# Altium project CAN_BUS.PrjPcb
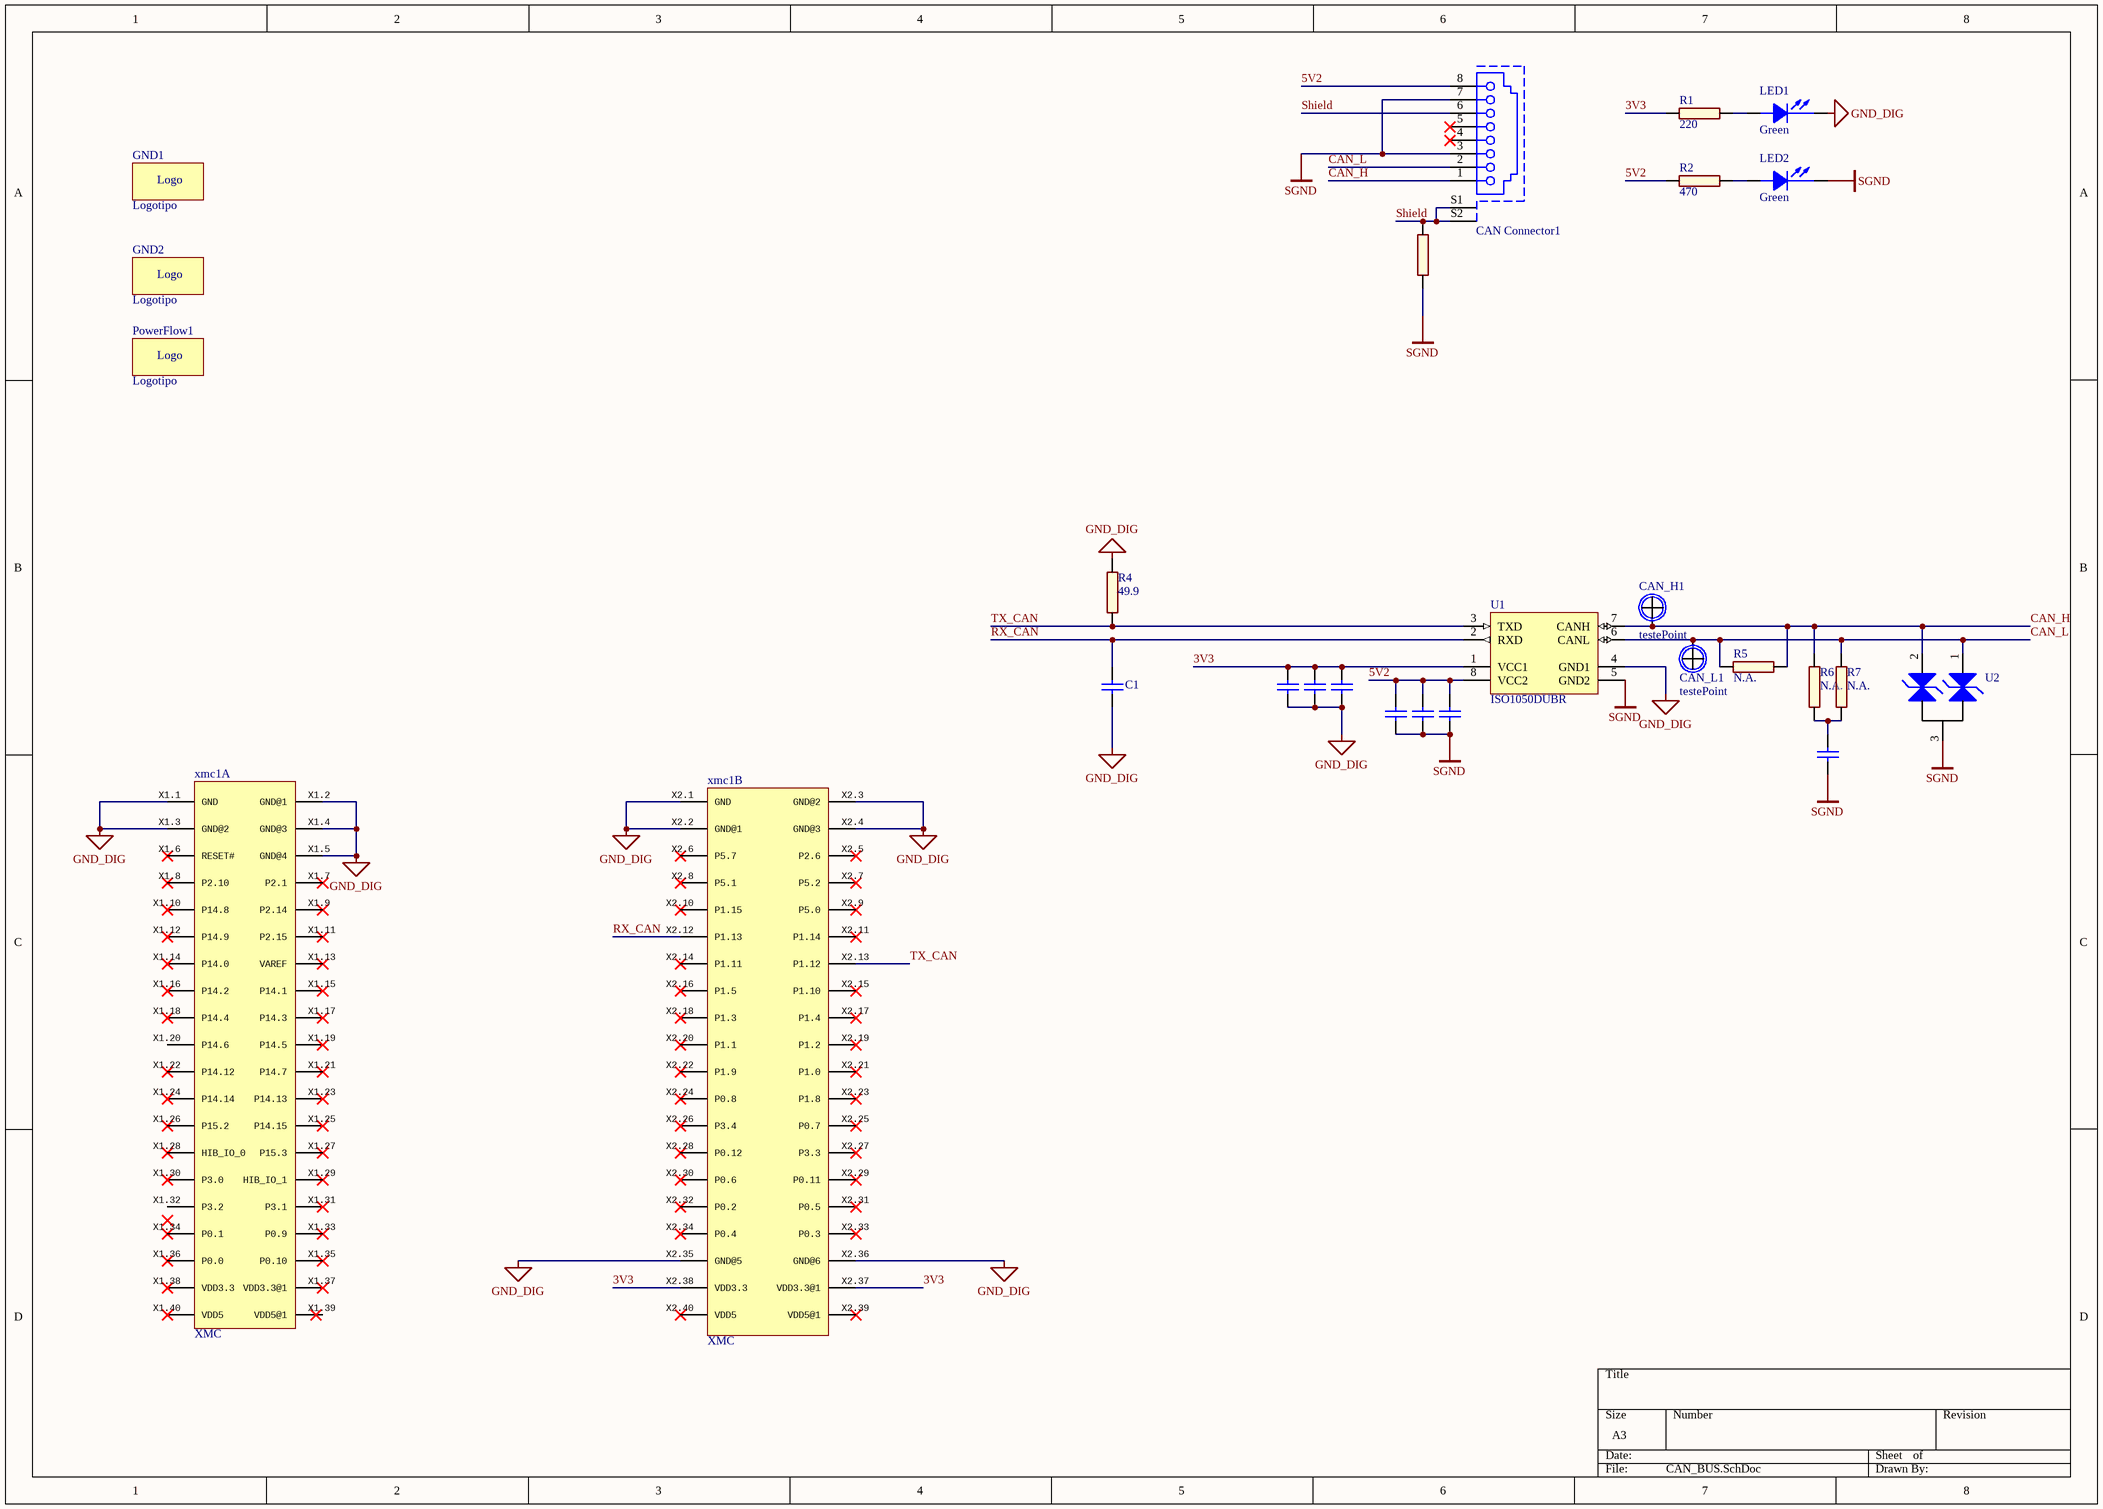
[diagram p0: CAN_BUS.SchDoc]
1 sheet, 26 parts. Net scope: global (net labels, ports and power ports of the same name join across sheets).
Board file: CAN_BUS.PcbDoc

## Sheet CAN_BUS.SchDoc
size A3

### Parts
C1  Capacitor  [CAPC_0805]  (value not drawn)
C2  Capacitor  [CAPC_0805]  (value not drawn)
C3  Capacitor  [CAPC_0805]  (value not drawn)
C4  Capacitor  [CAPC_0805]  (value not drawn)
C5  Capacitor  [CAPC_0805]  (value not drawn)
C6  Capacitor  [CAPC_0805]  (value not drawn)
C7  Capacitor  [CAPC_0805]  (value not drawn)
C8  Capacitor  [CAPC_0805]  (value not drawn)
CAN_Connector1  61500814221  [61500814221]  (value not drawn)
CAN_H1  testePoint  [PAD 2.5MM - FURO 1.25MM]
CAN_L1  testePoint  [PAD 2.5MM - FURO 1.25MM]
GND1  Logotipo  [Dangerous_Logo]
GND2  Logotipo  [Dangerous_Logo]
LED1  Green  [CD2012-0805]
LED2  Green  [CD2012-0805]
PowerFlow1  Logotipo  [PowerFlow_LOGO]
R1  220  [RESC_0805]
R2  470  [RESC_0805]
R3  N.A.  [RESC_0805]  (value not drawn)
R4  49.9  [RESC_0805]
R5  N.A.  [RESC_0805]
R6  N.A.  [RESC_0805]
R7  N.A.  [RESC_0805]
U1  ISO1050DUBR  [DUB8_M]
U2  Diode_TVS_Array  [SOT23-3]  (value not drawn)
xmc1  XMC  [XMC4500_Relax_Lite]  (parts A,B of 2)

### Nets
GND_DIG: C1.1 C2.1 C3.1 C4.1 LED1.C(CATHODE) R4.2 U1.4(GND1) xmc1.X1.1(GND) xmc1.X1.2(GND@1) xmc1.X1.3(GND@2) xmc1.X1.4(GND@3) xmc1.X1.5(GND@4) xmc1.X2.1(GND) xmc1.X2.2(GND@1) xmc1.X2.3(GND@2) xmc1.X2.4(GND@3) xmc1.X2.35(GND@5) xmc1.X2.36(GND@6)
SGND: C5.1 C6.1 C7.1 C8.2 CAN_Connector1.3 CAN_Connector1.7 LED2.C(CATHODE) R3.1 U1.5(GND2) U2.3
3V3: C2.2 C3.2 C4.2 R1.1 U1.1(VCC1) xmc1.X2.37(VDD3.3@1) xmc1.X2.38(VDD3.3)
5V2: C5.2 C6.2 C7.2 CAN_Connector1.8 R2.1 U1.8(VCC2)
CAN_H: CAN_Connector1.1 CAN_H1.1 R5.1 R6.2 U1.7(CANH) U2.2
CAN_L: CAN_Connector1.2 CAN_L1.1 R5.2 R7.2 U1.6(CANL) U2.1
RX_CAN: C1.2 U1.2(RXD) xmc1.X2.12(P1.13)
Shield: CAN_Connector1.6 CAN_Connector1.S1(Shield) CAN_Connector1.S2(Shield) R3.2
TX_CAN: R4.1 U1.3(TXD) xmc1.X2.13(P1.12)
NetC8_1: C8.1 R6.1 R7.1
NetLED1_A: LED1.A(ANODE) R1.2
NetLED2_A: LED2.A(ANODE) R2.2

Not connected (* = marked no-connect by the designer): CAN_Connector1 4* 5*; xmc1 X1.6(RESET#)* X1.7(P2.1)* X1.8(P2.10)* X1.9(P2.14)* X1.10(P14.8)* X1.11(P2.15)* X1.12(P14.9)* X1.13(VAREF)* X1.14(P14.0)* X1.15(P14.1)* X1.16(P14.2)* X1.17(P14.3)* X1.18(P14.4)* X1.19(P14.5)* X1.20(P14.6) X1.21(P14.7)* X1.22(P14.12)* X1.23(P14.13)* X1.24(P14.14)* X1.25(P14.15)* X1.26(P15.2)* X1.27(P15.3)* X1.28(HIB_IO_0)* X1.29(HIB_IO_1)* X1.30(P3.0)* X1.31(P3.1)* X1.32(P3.2) X1.33(P0.9)* X1.34(P0.1)* X1.35(P0.10)* X1.36(P0.0)* X1.37(VDD3.3@1)* X1.38(VDD3.3)* X1.39(VDD5@1) X1.40(VDD5)* X2.5(P2.6)* X2.6(P5.7)* X2.7(P5.2)* X2.8(P5.1)* X2.9(P5.0)* X2.10(P1.15)* X2.11(P1.14)* X2.14(P1.11)* X2.15(P1.10)* X2.16(P1.5)* X2.17(P1.4)* X2.18(P1.3)* X2.19(P1.2)* X2.20(P1.1)* X2.21(P1.0)* X2.22(P1.9)* X2.23(P1.8)* X2.24(P0.8)* X2.25(P0.7)* X2.26(P3.4)* X2.27(P3.3)* X2.28(P0.12)* X2.29(P0.11)* X2.30(P0.6)* X2.31(P0.5)* X2.32(P0.2)* X2.33(P0.3)* X2.34(P0.4)* X2.39(VDD5@1)* X2.40(VDD5)*

### Notes on the sheet
- (in symbol Logotipo) Logo

### Library data of the parts
C1 = Capacitor: Value: 15 pF; LCSC PART #: C1794
C2 = Capacitor: Value: 1u; LCSC PART #: C28323
C3 C6 = Capacitor: Value: 0.1 uF; LCSC PART #: C49678
C4 C7 = Capacitor: Value: 0.01 uF; LCSC PART #: C1710
C5 = Capacitor: Value: 1uF; LCSC PART #: C28323
C8 = Capacitor: Value: N.A.
CAN_Connector1 = 61500814221: Modular Jack Horizontal Shielded 8P8C Tab Down WR-MJ; Rated Current: 1.5 A; Working Voltage: 120 VAC; Withstanding Voltage: 1000 VAC; Port: 1x1; ComponentLink1Description: Manufacturer; ComponentLink1URL: http://www.we-online.de; ComponentLink2Description: Datasheet; ComponentLink2URL: http://katalog.we-online.com/em/datasheet/61500814221.pdf; Part Number: 61500814221; Published Date: September 2017; Publisher: Wurth Elektronik; Pin Number: 8P8C; Entrance: Horizontal
LED1 LED2 = LED_GREEN: LED 2X1.2MM 570NM GN WTR CLR SMD; Manufacturer: Kingbright; MPN: APT2012CGCK; VPN: 754-1127-1-ND; Vendor: Digikey; Value: Green; LCSC PART #: C2297
R1-R7 = R2: Thick film resistor, SMD 0402, 1/16W, 1%; Manufacturer: Generic
  R1: Value: 220; LCSC PART #: C17557
  R2: Value: 470
  R3 R5: Value: N.A.
  R4: Value: 49.9; LCSC PART #: C17720
  R6 R7: Value: N.A.; LCSC PART #: C17802
U1 = ISO1050DUBR: Isolated CAN Transceiver, -55 to 105 degC, 8-pin SOP (DUB), Green (RoHS & no Sb/Br); LCSC PART #: C16428
U2 = Diode_TVS_Array: Value: SM24CANB-02HTG; LCSC PART #: C151237